# Altium schematic sheet CAN.SchDoc
size B; SheetNumber: 3; SheetTotal: 6
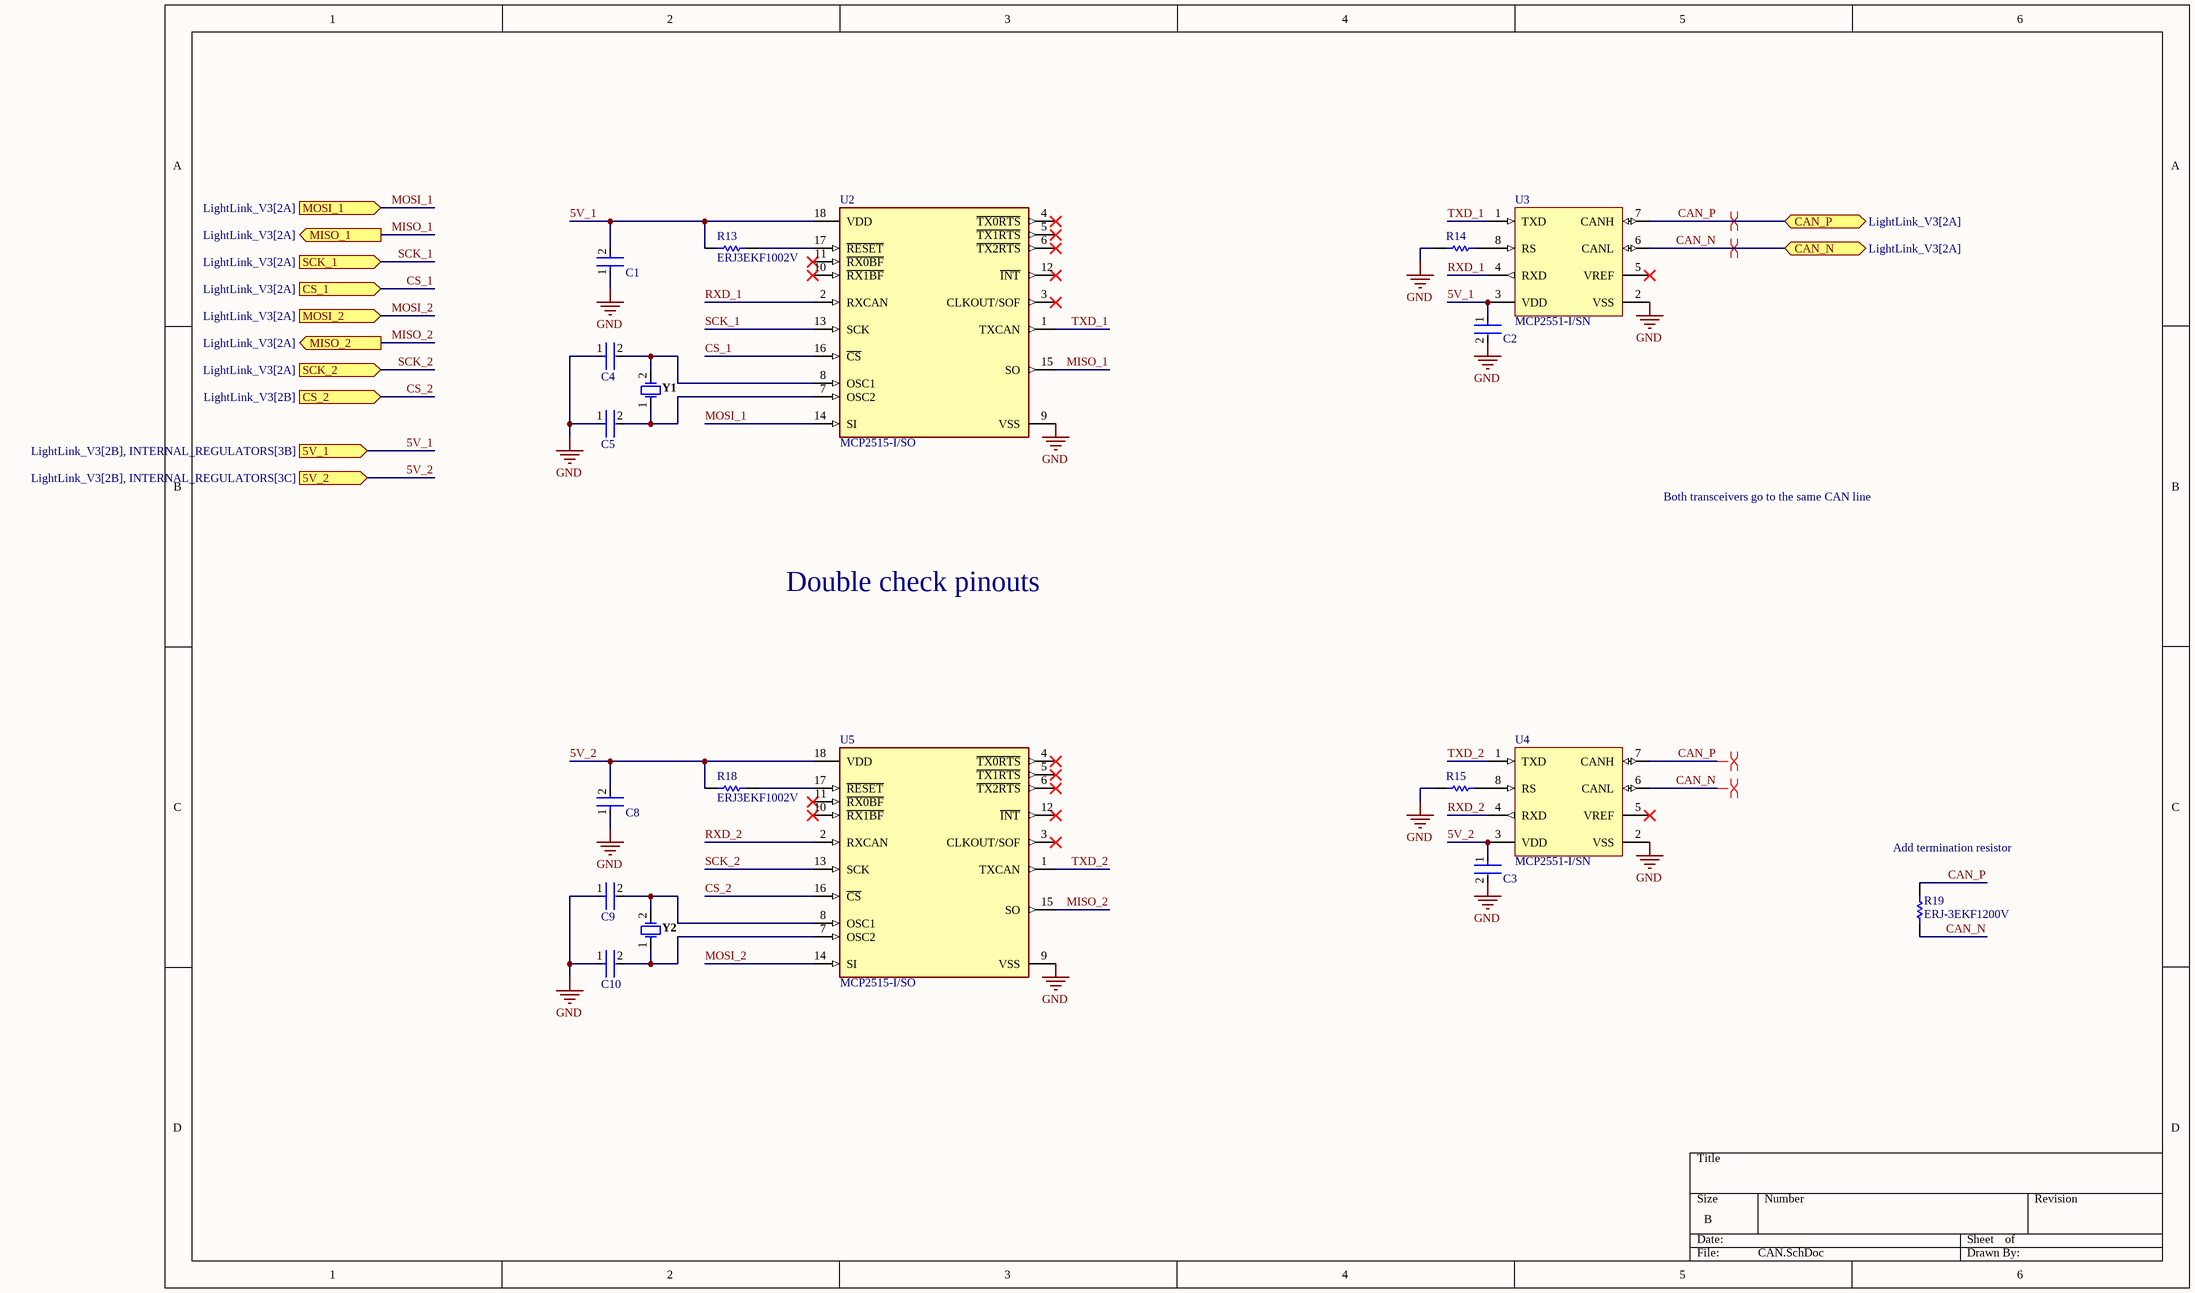
[diagram p0: CAN.SchDoc]

## Parts
C1  GRM188R60J106ME47D  [FP-GRM188-0_1-e0_2_0_55-IPC_A]  (value not drawn)
C2  C0402C104K8PACTU  [FP-C0402-BB-MFG]  (value not drawn)
C3  C0402C104K8PACTU  [FP-C0402-BB-MFG]  (value not drawn)
C4  GRM188R60J106ME47D  [FP-GRM188-0_1-e0_2_0_55-IPC_A]  (value not drawn)
C5  GRM188R60J106ME47D  [FP-GRM188-0_1-e0_2_0_55-IPC_A]  (value not drawn)
C8  GRM188R60J106ME47D  [FP-GRM188-0_1-e0_2_0_55-IPC_A]  (value not drawn)
C9  GRM188R60J106ME47D  [FP-GRM188-0_1-e0_2_0_55-IPC_A]  (value not drawn)
C10  GRM188R60J106ME47D  [FP-GRM188-0_1-e0_2_0_55-IPC_A]  (value not drawn)
R13  ERJ3EKF1002V  [RESC1609X55X30LL15T15]
R14  ERJ3EKF1002V  [RESC1609X55X30LL15T15]  (value not drawn)
R15  ERJ3EKF1002V  [RESC1609X55X30LL15T15]  (value not drawn)
R18  ERJ3EKF1002V  [RESC1609X55X30LL15T15]
R19  ERJ-3EKF1200V  [RESC1609X55X30ML15T15]
U2  MCP2515-I/SO  [FP-C04-051-MFG]
U3  MCP2551-I/SN  [MCHP-SN8_V]
U4  MCP2551-I/SN  [MCHP-SN8_V]
U5  MCP2515-I/SO  [FP-C04-051-MFG]
Y1  FOXSLF/160-20  [FOX-FOXSLF160-20]  (value not drawn)
Y2  FOXSLF/160-20  [FOX-FOXSLF160-20]  (value not drawn)

## Ports
5V_1 (in, see LightLink_V3[2B], INTERNAL_REGULATORS[3B]), 5V_2 (in, see LightLink_V3[2B], INTERNAL_REGULATORS[3C]), CAN_N (bidir, see LightLink_V3[2A]), CAN_P (bidir, see LightLink_V3[2A]), CS_1 (in, see LightLink_V3[2A]), CS_2 (in, see LightLink_V3[2B]), MISO_1 (out, see LightLink_V3[2A]), MISO_2 (out, see LightLink_V3[2A]), MOSI_1 (in, see LightLink_V3[2A]), MOSI_2 (in, see LightLink_V3[2A]), SCK_1 (in, see LightLink_V3[2A]), SCK_2 (in, see LightLink_V3[2A])

## Nets
GND: C1.1 C2.2 C3.2 C4.1 C5.1 C8.1 C9.1 C10.1 R14.1 R15.1 U2.9(VSS) U3.2(VSS) U4.2(VSS) U5.9(VSS)
5V_1: C1.2 C2.1 R13.1 U2.18(VDD) U3.3(VDD) ; port 5V_1
5V_2: C3.1 C8.2 R18.1 U4.3(VDD) U5.18(VDD) ; port 5V_2
CAN_N: R19.1 U3.6(CANL) U4.6(CANL) ; port CAN_N
CAN_P: R19.2 U3.7(CANH) U4.7(CANH) ; port CAN_P
CS_1: U2.16(~{CS}) ; port CS_1
CS_2: U5.16(~{CS}) ; port CS_2
MISO_1: U2.15(SO) ; port MISO_1
MISO_2: U5.15(SO) ; port MISO_2
MOSI_1: U2.14(SI) ; port MOSI_1
MOSI_2: U5.14(SI) ; port MOSI_2
RXD_1: U2.2(RXCAN) U3.4(RXD)
RXD_2: U4.4(RXD) U5.2(RXCAN)
SCK_1: U2.13(SCK) ; port SCK_1
SCK_2: U5.13(SCK) ; port SCK_2
TXD_1: U2.1(TXCAN) U3.1(TXD)
TXD_2: U4.1(TXD) U5.1(TXCAN)
NetC4_2: C4.2 U2.8(OSC1) Y1.2
NetC5_2: C5.2 U2.7(OSC2) Y1.1
NetC9_2: C9.2 U5.8(OSC1) Y2.2
NetC10_2: C10.2 U5.7(OSC2) Y2.1
NetR13_2: R13.2 U2.17(~{RESET})
NetR14_2: R14.2 U3.8(RS)
NetR15_2: R15.2 U4.8(RS)
NetR18_2: R18.2 U5.17(~{RESET})

Not connected (* = marked no-connect by the designer): U2 3(CLKOUT/SOF)* 4(~{TX0RTS})* 5(~{TX1RTS})* 6(~{TX2RTS})* 10(~{RX1BF})* 11(~{RX0BF})* 12(~{INT})*; U3 5(VREF)*; U4 5(VREF)*; U5 3(CLKOUT/SOF)* 4(~{TX0RTS})* 5(~{TX1RTS})* 6(~{TX2RTS})* 10(~{RX1BF})* 11(~{RX0BF})* 12(~{INT})*

## Layout directives
differential pair: CAN_N, CAN_P

## Notes on the sheet
- Both transceivers go to the same CAN line
- Double check pinouts
- (near R19) Add termination resistor

## Library data of the parts
C1 C4 C5 C8-C10 = CMP-2006-02792-2: Chip Multilayer Ceramic Capacitors for General Purpose, 0603, 10uF, X5R, 15%, 20%, 6.3V; Packaging: Tape and Reel; Voltage Rating (DC): 6.3V; Width: 0.031inch; Termination: SMD/SMT; Dielectric: X5R; Package Quantity: 4000; Voltage Rating: 6.3V; Capacitance: 10uF; Case/Package: 0603; Min Operating Temperature: -55°C; Voltage: 6.3V; Length: 1.6mm; Thickness: 0.035inch; Lead Free: Lead Free; Depth: 0.8mm; Case Code (Imperial): 0603; Max Operating Temperature: 85°C; Material: Ceramic; Height: 0.8mm; Tolerance: 20%; Mount: Surface Mount; REACH SVHC: No SVHC; Radiation Hardening: No; Case Code (Metric): 1608
C2 C3 = CMP-2008-02046-2: CAP CER 0.1UF 10V X5R 0402; Manufacturer: Kemet; Material: Ceramic; Capacitance: 0.10 μF; Temperature Coefficient: 15%; Tolerance: 0.1; Value: 0.10 μF; Package: C0402-BB; Temperature: -55°C to +125°C; ComponentLink2Description: Datasheet; Temperature Characteristic: X5R; Device Class L1: Passive Components; Height: 0.55mm; Lead Free: Yes; ComponentLink2URL: https://content.kemet.com/datasheets/KEM_C1002_X7R_SMD.pdf; Device Class L2: Capacitors; Temperature Range Low: -55°C; Temperature Range High: +125°C; RoHS: TRUE; Octopart: https://octopart.com/c0402c104k8pactu-kemet-140039; Automotive: No; Mouser Description: Capacitor 100 nF 10 VDC 0402; Category: Cap; Voltage Rating: 10 V; Digikey Description: CAP CER 0.1UF 10V X5R 0402; Ipc Land Pattern Name: CAPC10050X50; Device Class L3: Ceramic Capacitors; Manufacturer Part Number: C0402C104K8PACTU
R13-R15 R18 = CMP-1012-00623-3: Chip Resistor, 10 KOhm, +/- 1%, 0.1 W, -55 to 155 degC, 0603 (1608 Metric), RoHS, Tape and Reel; Manufacturer: Panasonic; Voltage Rating: 75V; Case\/Package: 0603; Power Rating: 100mW; Resistance: 10KOhm; Temperature Coefficient: 100ppm\/degreesC; Number of Pins: 2; Package Reference: 603; Depth: 0.8mm; Mount: SurfaceMount; Package Description: 2-Pin Surface Mount Device, Body 1.6 x 0.85 mm; Datasheet Version: 02/2017; Length: 1.6mm; Lead Free: LeadFree; Height: 0.45mm; Number of Terminations: 2; Max Power Dissipation: 100mW; Min Operating Temperature: -55degC; Datasheet URL: https://industrial.panasonic.com/cdbs/www-data/pdf/RDA0000/AOA0000C304.pdf; Termination: SMD/SMT; Case Code (Metric): 1608; Case Code (Imperial): 0603; Tolerance: 1%; Max Operating Temperature: 155degC; RoHSCompliant: true; Voltage Rating (DC): 75V; Radiation Hardening: No; Packaging: TapeandReel; Composition: ThickFilm; Mounting Technology: SurfaceMount; Manufacturer URL: http://www.panasonic.com/; Width: 0.031inch; REACH SVHC: NoSVHC; Contact Plating: Tin; Military Standard: Not; Package Quantity: 1
R19 = CMP-2000-00213-2: Chip Resistor, 120 Ohm, +/- 1%, 0.1 W, -55 to 155 degC, 0603 (1608 Metric), RoHS, Tape and Reel; Manufacturer: Panasonic; Power Rating: 100mW; Voltage Rating (DC): 75V; Resistance: 120Ohm; Temperature Coefficient: 100ppm/degreesC; Number of Terminations: 2; Military Standard: Not; Tolerance: 1%; Min Operating Temperature: -55degC; Packaging: TapeandReel; Lead Free: LeadFree; Max Operating Temperature: 155degC; Manufacturer URL: http://www.panasonic.com/; Case Code (Imperial): 0603; REACH SVHC: NoSVHC; Width: 0.031inch; Datasheet URL: https://industrial.panasonic.com/cdbs/www-data/pdf/RDA0000/AOA0000C283.pdf; RoHSCompliant: true; Max Power Dissipation: 100mW; Termination: SMD/SMT; Package Reference: 0603; Height: 0.022inch; Depth: 0.8mm; Package Description: 2-Pin Surface Mount Device, Body 1.6 x 0.85 mm; Contact Plating: Tin; Length: 1.6mm; Package URL: http://www.st.com/st-web-ui/static/active/en/resource/technical/document/datasheet/CD00001320.pdf; Radiation Hardening: No; Package Quantity: 1; Number of Pins: 2; Datasheet Version: 42095.0; Voltage Rating: 75V; Composition: ThickFilm; Case/Package: 0603; Mount: SurfaceMount; Case Code (Metric): 1608
U2 U5 = CMP-0186-00133-3: IC CAN CONTROLLER W/SPI 18SOIC; Manufacturer: Microchip; Min Supply Voltage: 2.7V; Max Supply Voltage: 5.5V; Standoff Height: 0.1mm; Nominal Supply Current: 10mA; Interface: SPI,CAN; Lead Free: Yes; Digikey Description: IC CAN CONTROLLER W/SPI 18SOIC; Category: IC; RoHS: TRUE; Manufacturer Part Number: MCP2515-I/SO; ComponentLink2URL: http://ww1.microchip.com/downloads/en/DeviceDoc/MCP2515-Stand-Alone-CAN-Controller-with-SPI-20001801J.pdf; Mouser Description: CAN Interface IC W/ SPI Interface; Device Class L2: Interface ICs; Package: C04-051; Automotive: No; Function: Controller; Octopart: https://octopart.com/mcp2515-i%2Fso-microchip-430187; Temperature: -40°C to +85°C; Ipc Land Pattern Name: SOIC127P1030X265-18; Ambient Temperature Range Low: -65°C; Height: 2.65mm; Device Class L1: Integrated Circuits (ICs); Ambient Temperature Range High: +125°C; Footprint Url: http://ww1.microchip.com/downloads/en/DeviceDoc/18L_SOIC_Wide_7.50_SO_C04-0051D.pdf; Temperature Range Low: -40°C; Device Class L3: Controllers; Temperature Range High: +85°C; ComponentLink2Description: Datasheet
U3 U4 = CMP-0186-00138-3: High-Speed CAN Transceiver, / 1 Mb/s, 4.5 to 5.5 V, 8-Pin SOIC (SN), Industrial Temperature, RoHS, Tube; Manufacturer: Microchip; RoHSCompliant: true; PackageReference: SN8; ComponentLink1URL: http://www.microchip.com/; DatasheetVersion: Rev. F, 07/2010; ComponentLink2Description: Datasheet; ComponentLink2URL: http://ww1.microchip.com/downloads/en/DeviceDoc/21667f.pdf; ComponentLink3Description: Package Specification; PackageDescription: 8-Pin Small Outline Integrated Circuit, Body 4.9 x 3.9 mm, Pitch 1.27 mm; ComponentLink1Description: Manufacturer URL; Mounting Technology: Surface Mount; ComponentLink3URL: http://www.microchip.com/stellent/groups/techpub_sg/documents/packagingspec/en012702.pdf
Y1 Y2 = CMP-1749-00003-1: Resistance Weld Thru-Hole Crystal, 16 MHz, -20 to 70 degC, 2-Pin THD, RoHS, Bulk; Voltage Rating: 250 V; Tolerance: 1%; Resistance: 221 kohm; Case\Package: Axial; Power Rating: 250 mW; RoHSCompliant: true; Package Quantity: 200; Packaging: Bulk; Min Operating Temperature: -55 degC; DatasheetVersion: Mar-15; ComponentLink1URL: http://www.foxonline.com/; Max Operating Temperature: 155 degC; PackageReference: FOXSLF160-20; Mount: Through Hole; PackageDescription: 2-Pin Through Hole Device, Body 11.35 x 4.65 mm; ComponentLink1Description: Manufacturer URL; ComponentLink2URL: http://www.foxonline.com/pdfs/hc49slf.pdf; ComponentLink2Description: Datasheet; Length: 0.248 inch